# Altium schematic sheet [02] BLOCK DIAGRAM.SchDoc: Template
size A4; Author: Hom; CompanyName: KitSprout; DrawnBy: Hom; Engineer: Hom; Organization: KitSprout; Revision: A; SheetNumber: 2; SheetTotal: 1; Version: 0.0; LibVersion: 0.0
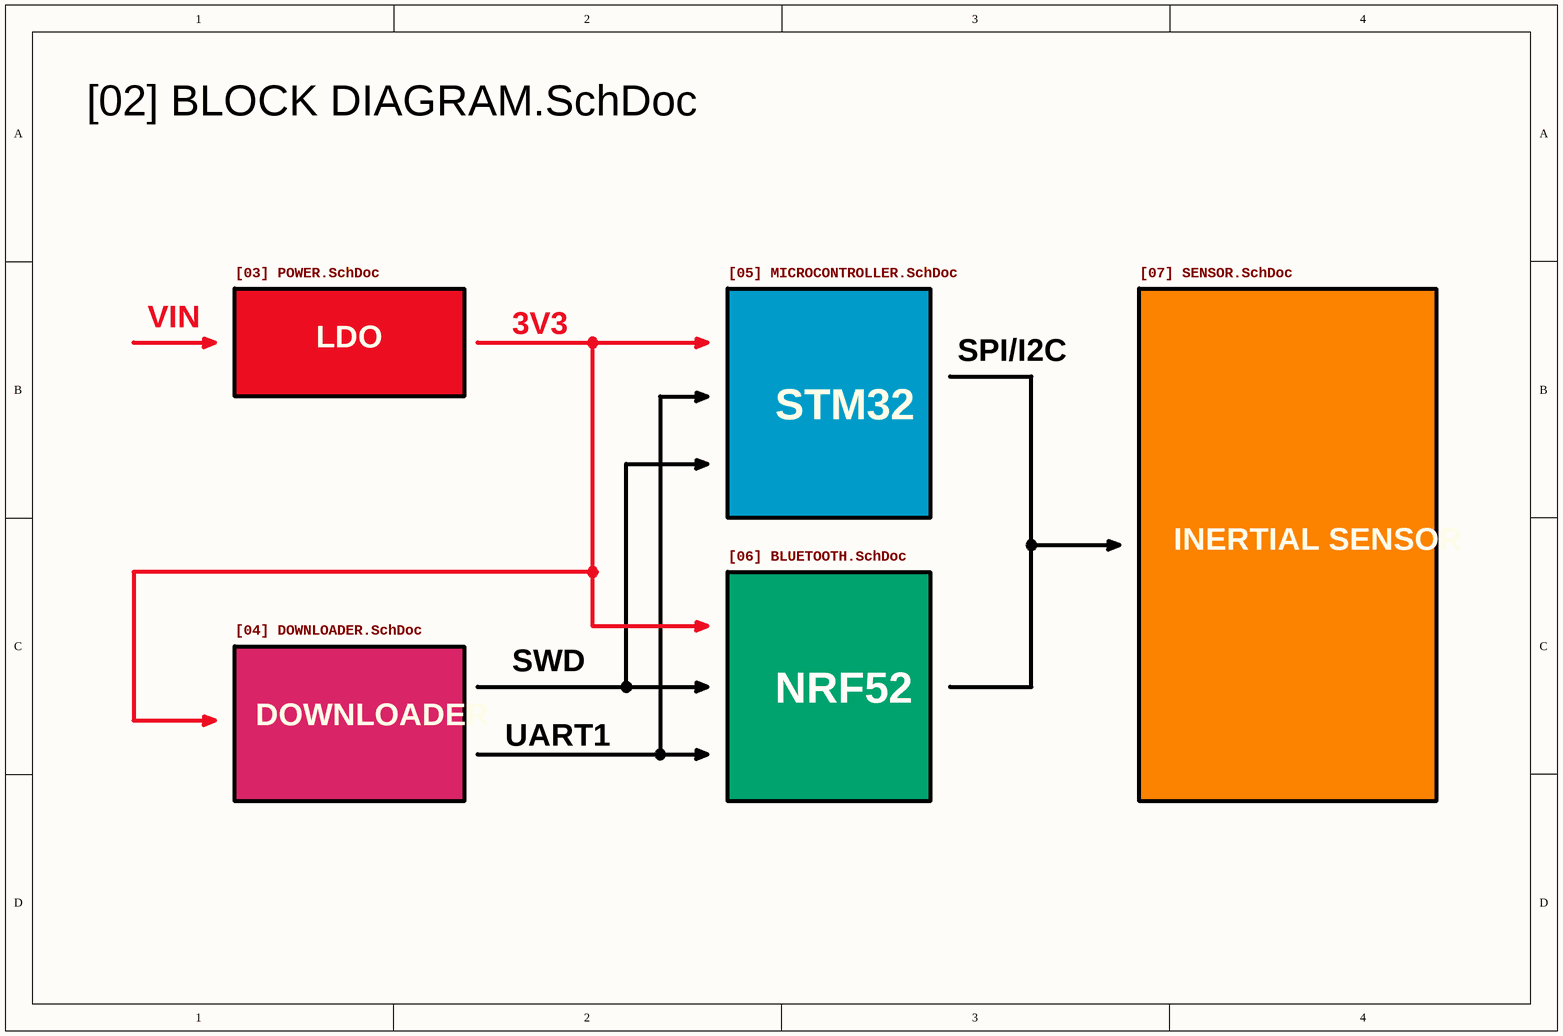
[diagram p0: [02] BLOCK DIAGRAM.SchDoc]

## Sub-sheets
DOWNLOADER = [04] DOWNLOADER.SchDoc: no entries
INERTIAL SENSOR = [07] SENSOR.SchDoc: no entries
LDO = [03] POWER.SchDoc: no entries
NRF52 = [06] BLUETOOTH.SchDoc: no entries
STM32 = [05] MICROCONTROLLER.SchDoc: no entries

## Notes on the sheet
- VIN
- 3V3
- SPI/I2C
- SWD
- UART1